# EAGLE schematic OttoPi06a-RPi3AHAT (EAGLE 9.6.2)
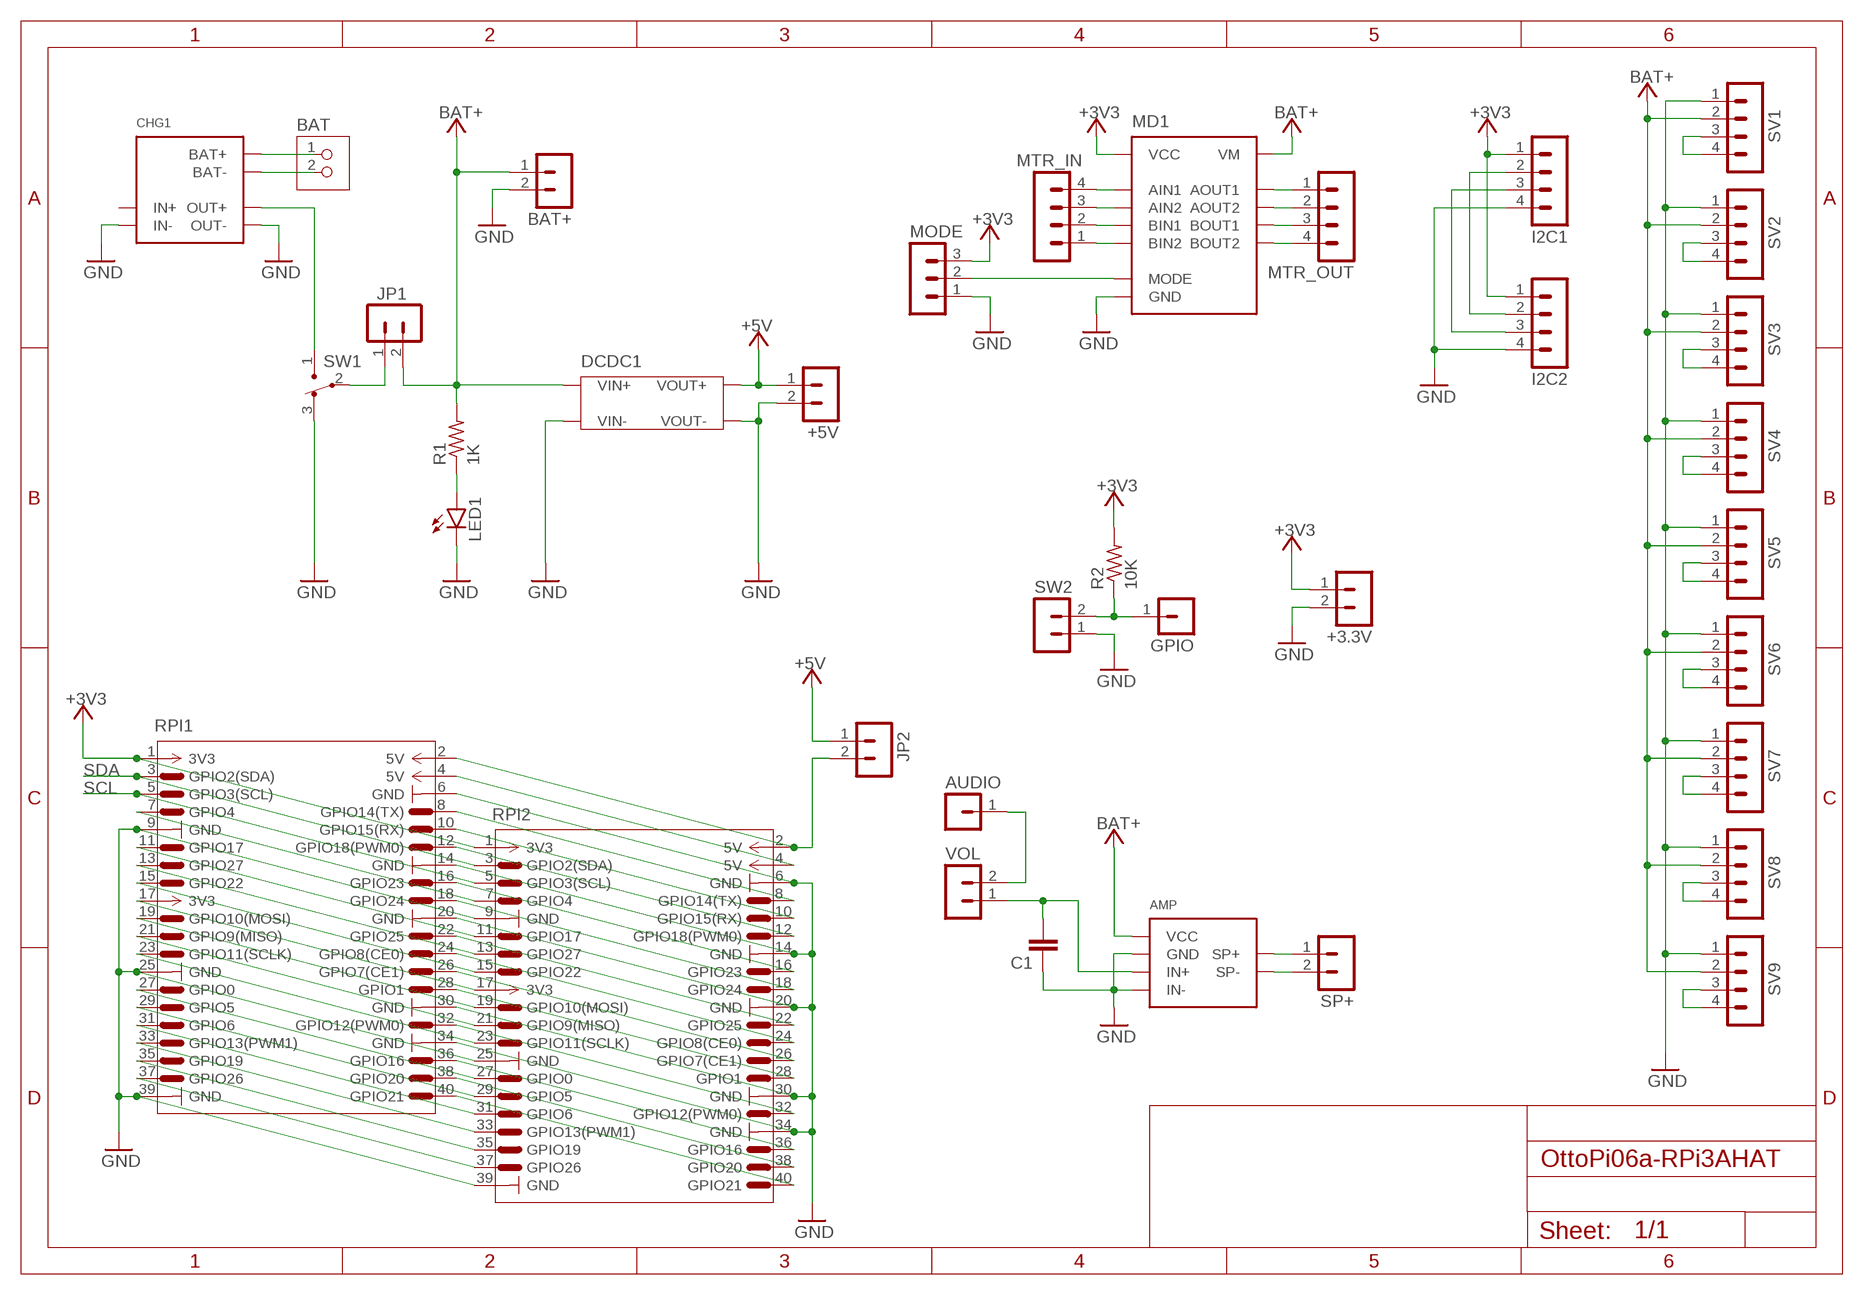
[diagram p0: schematic, sheet 1]

## Parts
+3.3V  PINHEAD-MA02-1  [PINHEAD-MA02-1]
+5V  PINHEAD-MA02-1  [PINHEAD-MA02-1]
AMP  PAM8012MOD  [PAM8012MOD-A]
AUDIO  PINHEAD-MA01-1  [PINHEAD-MA01-1]
BAT  JST-PH2  [JST-PH2]
BAT+  PINHEAD-MA02-1  [PINHEAD-MA02-1]
C1  C-EU025-024X044  [C025-024X044]
CHG1  TP4056MOD1  [TP4056MOD1]
DCDC1  DCDC-MT3608-MODUSB  [DCDC-MT3608-MOD2-USB]
GPIO  PINHEAD-MA01-1  [PINHEAD-MA01-1]
I2C1  PINHEAD-MA04-1  [PINHEAD-MA04-1]
I2C2  PINHEAD-MA04-1  [PINHEAD-MA04-1]
JP1  PINHEAD-MA02-1  [PINHEAD-MA02-1]
JP2  PINHEAD-MA02-1  [PINHEAD-MA02-1]
LED1  LED3MM  [LED3MM]
MD1  DRV8835MOD  [DRV8835MOD]
MODE  PINHEAD-MA03-1  [PINHEAD-MA03-1]
MTR_IN  PINHEAD-MA04-1  [PINHEAD-MA04-1]
MTR_OUT  PINHEAD-MA04-1  [PINHEAD-MA04-1]
R1  1K  R-US_0204/7  [0204/7]
R2  10K  R-US_0204/7  [0204/7]
RPI1  RPI-PIN  [RPI-PIN]
RPI2  RPI-PIN  [RPI-PIN]
SP+  PINHEAD-MA02-1  [PINHEAD-MA02-1]
SV1  PINHEAD-MA04-1  [PINHEAD-MA04-1]
SV2  PINHEAD-MA04-1  [PINHEAD-MA04-1]
SV3  PINHEAD-MA04-1  [PINHEAD-MA04-1]
SV4  PINHEAD-MA04-1  [PINHEAD-MA04-1]
SV5  PINHEAD-MA04-1  [PINHEAD-MA04-1]
SV6  PINHEAD-MA04-1  [PINHEAD-MA04-1]
SV7  PINHEAD-MA04-1  [PINHEAD-MA04-1]
SV8  PINHEAD-MA04-1  [PINHEAD-MA04-1]
SV9  PINHEAD-MA04-1  [PINHEAD-MA04-1]
SW1  SW3-1  [SW3-1]
SW2  PINHEAD-MA02-1  [PINHEAD-MA02-1]
VOL  PINHEAD-MA02-1  [PINHEAD-MA02-1]

## Nets
+3V3: +3.3V.1 I2C1.1 I2C2.1 MD1.VCC MODE.3 R2.2 RPI1.1(3V3) RPI2.1(3V3)
+5V: +5V.1 DCDC1.VOUT+ JP2.1
AIN1: MD1.AIN1 MTR_IN.4
AIN2: MD1.AIN2 MTR_IN.3
AOUT1: MD1.AOUT1 MTR_OUT.1
AOUT2: MD1.AOUT2 MTR_OUT.2
AUDIO0: AUDIO.1 VOL.2
AUDIO1: AMP.IN+ C1.2 VOL.1
BAT+: AMP.V+(VCC) BAT+.1 DCDC1.VIN+ JP1.2 MD1.VM R1.2 SV1.2 SV2.2 SV3.2 SV4.2 SV5.2 SV6.2 SV7.2 SV8.2 SV9.2
BAT+0: BAT.1 CHG1.BAT+
BAT+1: CHG1.OUT+ SW1.1
BAT+2: JP1.1 SW1.2
BAT-0: BAT.2 CHG1.BAT-
BIN1: MD1.BIN1 MTR_IN.2
BIN2: MD1.BIN2 MTR_IN.1
BOUT1: MD1.BOUT1 MTR_OUT.3
BOUT2: MD1.BOUT2 MTR_OUT.4
GND: +3.3V.2 +5V.2 AMP.GND AMP.IN- BAT+.2 C1.1 CHG1.IN- CHG1.OUT- DCDC1.VIN- DCDC1.VOUT- I2C1.4 I2C2.4 LED1.K(C) MD1.GND MODE.1 RPI1.6(GND) RPI1.9(GND) RPI1.14(GND) RPI1.20(GND) RPI1.25(GND) RPI1.30(GND) RPI1.34(GND) RPI1.39(GND) RPI2.6(GND) RPI2.9(GND) RPI2.14(GND) RPI2.20(GND) RPI2.25(GND) RPI2.30(GND) RPI2.34(GND) RPI2.39(GND) SV1.1 SV2.1 SV3.1 SV4.1 SV5.1 SV6.1 SV7.1 SV8.1 SV9.1 SW1.3 SW2.1
MODE: MD1.MODE MODE.2
N$1: RPI1.17(3V3) RPI2.17(3V3)
N$2: SV7.3 SV7.4
N$3: LED1.A R1.1
N$4: GPIO.1 R2.1 SW2.2
N$5: SV8.3 SV8.4
N$6: JP2.2 RPI1.2(5V) RPI2.2(5V)
N$7: RPI1.7(GPIO4) RPI2.7(GPIO4)
N$8: SV9.3 SV9.4
N$9: RPI1.11(GPIO17) RPI2.11(GPIO17)
N$10: RPI1.13(GPIO27) RPI2.13(GPIO27)
N$11: RPI1.15(GPIO22) RPI2.15(GPIO22)
N$12: RPI1.23(GPIO11(SCLK)) RPI2.23(GPIO11(SCLK))
N$13: RPI1.19(GPIO10(MOSI)) RPI2.19(GPIO10(MOSI))
N$14: RPI1.21(GPIO9(MISO)) RPI2.21(GPIO9(MISO))
N$16: RPI1.4(5V) RPI2.4(5V)
N$18: RPI1.8(GPIO14(TX)) RPI2.8(GPIO14(TX))
N$19: RPI1.10(GPIO15(RX)) RPI2.10(GPIO15(RX))
N$20: RPI1.12(GPIO18(PWM0)) RPI2.12(GPIO18(PWM0))
N$21: RPI1.16(GPIO23) RPI2.16(GPIO23)
N$22: RPI1.18(GPIO24) RPI2.18(GPIO24)
N$23: RPI1.22(GPIO25) RPI2.22(GPIO25)
N$27: RPI1.24(GPIO8(CE0)) RPI2.24(GPIO8(CE0))
N$28: RPI1.26(GPIO7(CE1)) RPI2.26(GPIO7(CE1))
N$29: RPI1.27(GPIO0) RPI2.27(GPIO0)
N$30: RPI1.28(GPIO1) RPI2.28(GPIO1)
N$31: RPI1.29(GPIO5) RPI2.29(GPIO5)
N$32: RPI1.31(GPIO6) RPI2.31(GPIO6)
N$33: RPI1.32(GPIO12(PWM0)) RPI2.32(GPIO12(PWM0))
N$34: RPI1.33(GPIO13(PWM1)) RPI2.33(GPIO13(PWM1))
N$35: RPI1.35(GPIO19) RPI2.35(GPIO19)
N$36: RPI1.36(GPIO16) RPI2.36(GPIO16)
N$37: RPI1.37(GPIO26) RPI2.37(GPIO26)
N$38: RPI1.38(GPIO20) RPI2.38(GPIO20)
N$39: RPI1.40(GPIO21) RPI2.40(GPIO21)
N$47: SV2.3 SV2.4
N$48: SV3.3 SV3.4
N$49: SV4.3 SV4.4
N$51: SV1.3 SV1.4
N$63: SV5.3 SV5.4
N$64: SV6.3 SV6.4
SCL: I2C1.3 I2C2.3 RPI1.5(GPIO3(SCL)) RPI2.5(GPIO3(SCL))
SDA: I2C1.2 I2C2.2 RPI1.3(GPIO2(SDA)) RPI2.3(GPIO2(SDA))
SP+: AMP.SP+@1(SP+) SP+.1
SP-: AMP.SP-@1(SP-) SP+.2
Unconnected: CHG1.IN+

## Library data of the parts
+3.3V +5V BAT+ JP1 JP2 SP+ SW2 VOL = ytani1:PINHEAD-MA02-1: PIN HEADER
AMP = ytani1:PAM8012MOD: PAM8012使用2W D級アンプモジュール https://akizukidenshi.com/catalog/g/gK-08217/ Vin: 2.5V-5.5V 8ohm: 1W 4ohm: 2W IN-をGNDに接続することでシングルエンド入力としても使用できます。; CHIP1: PAM8012; OC_AKIZUKI: K-08217; URL_AKIZUKI: https://akizukidenshi.com/catalog/g/gK-08217/
AUDIO GPIO = ytani1:PINHEAD-MA01-1
BAT = ytani1:JST-PH2
C1 = rcl:C-EU: CAPACITOR, European symbol; SPICEPREFIX: C
CHG1 = ytani1:TP4056MOD1: LiPoバッテリー充電コントローラ(TP4056) https://www.amazon.co.jp/dp/B073J66H62/; URL_AMAZON: https://www.amazon.co.jp/dp/B073J66H62/
DCDC1 = ytani1:DCDC-MT3608-MOD: DC/DC Step-Up converter MT3608 https://www.amazon.co.jp/gp/product/B086GDTYDS/ https://www.amazon.co.jp/gp/product/B01D0WSBGY/ MT3608 In 2V-24V Out 5V-28V = [VALUE] Max: 2A (1A recomended); AMAZON_URL: https://www.amazon.co.jp/gp/product/B01D0WSBGY/
I2C1 I2C2 MTR_IN MTR_OUT SV1-SV9 = ytani1:PINHEAD-MA04-1: PIN HEADER; OC_FARNELL: unknown; OC_NEWARK: unknown
LED1 = led:LED: LED OSRAM: - CHIPLED LG R971, LG N971, LY N971, LG Q971, LY Q971, LO R971, LY R971 LH N974, LH R974 LS Q976, LO Q976, LY Q976 LO Q996 - Hyper CHIPLED LW Q18S LB Q993, LB Q99A, LB R99A - SideLED LS A670, LO A670, LY A670, LG A670, LP A670 LB A673, LV A673, LT A673, LW A673 LH A674 LY A675 LS A676, LA A676, LO A676, LY A676, LW A676 LS A679, LY A679, LG A679 - Hyper Micro SIDELED® LS Y876, LA Y876, LO Y876, LY Y876 LT Y87S - SmartLED LW L88C, LW L88S LB L89C, LB L89S, LG L890 LS L89K, LO L89K, LY L89K LS L896, LA L896, LO L896, LY L896 - TOPLED LS T670, LO T670, LY T670, LG T670, LP T670 LSG T670, LSP T670, LSY T670, LOP T670, LYG T670 LG T671, LOG T671, LSG T671 LB T673, LV T673, LT T673, LW T673 LH T674 LS T676, LA T676, LO T676, LY T676, LB T676, LH T676, LSB T676, LW T676 LB T67C, LV T67C, LT T67C, LS T67K, LO T67K, LY T67K, LW E67C LS E67B, LA E67B, LO E67B, LY E67B, LB E67C, LV E67C, LT E67C LW T67C LS T679, LY T679, LG T679 LS T770, LO T770, LY T770, LG T770, LP T770 LB T773, LV T773, LT T773, LW T773 LH T774 LS E675, LA E675, LY E675, LS T675 LS T776, LA T776, LO T776, LY T776, LB T776 LHGB T686 LT T68C, LB T68C - Hyper Mini TOPLED® LB M676 - Mini TOPLED Santana® LG M470 LS M47K, LO M47K, LY M47K Source: http://www.osram.convergy.de LUXEON: - LUMILED® LXK2-PW12-R00, LXK2-PW12-S00, LXK2-PW14-U00, LXK2-PW14-V00 LXK2-PM12-R00, LXK2-PM12-S00, LXK2-PM14-U00 LXK2-PE12-Q00, LXK2-PE12-R00, LXK2-PE12-S00, LXK2-PE14-T00, LXK2-PE14-U00 LXK2-PB12-K00, LXK2-PB12-L00, LXK2-PB12-M00, LXK2-PB14-N00, LXK2-PB14-P00, LXK2-PB14-Q00 LXK2-PR12-L00, LXK2-PR12-M00, LXK2-PR14-Q00, LXK2-PR14-R00 LXK2-PD12-Q00, LXK2-PD12-R00, LXK2-PD12-S00 LXK2-PH12-R00, LXK2-PH12-S00 LXK2-PL12-P00, LXK2-PL12-Q00, LXK2-PL12-R00 Source: www.luxeon.com KINGBRIGHT: KA-3528ASYC Source: www.kingbright.com
MD1 = ytani1:DRV8835MOD: DRV8835 Motor Driver Module https://akizukidenshi.com/catalog/g/gK-09848/ Vcc = 2V-7V Vm = 0V-11V Iout = 0V-1.5A Fpwm = 0Hz-250kHz Vin = 0V-Vcc; OC_AKIZUKI: K-09848; URL_AKIZUKI: https://akizukidenshi.com/catalog/g/gK-09848/
MODE = ytani1:PINHEAD-MA03-1: PIN HEADER; OC_FARNELL: unknown; OC_NEWARK: unknown
R1 R2 = rcl:R-US_: RESISTOR, American symbol; SPICEPREFIX: R
RPI1 RPI2 = ytani1:RPI-PIN: Raspberry Pi pin header
SW1 = ytani1:SW3-1: Slide Switch 3x1 pin https://www.amazon.co.jp/gp/product/B01LYVYQNO/ SS12D00G3 2ポジションSPDT 1P2T 3ピン; MF: HiLetgo; URL_AMAZON: https://www.amazon.co.jp/gp/product/B01LYVYQNO/